# EAGLE design proto (EAGLE 7.3.0)
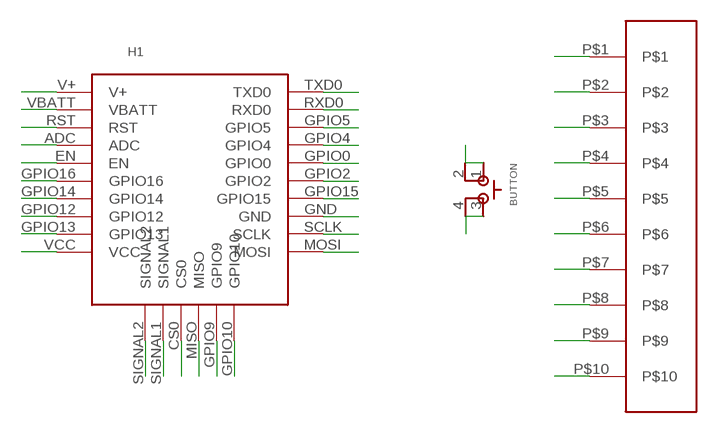
[diagram p0: schematic, sheet 1]

## Parts
BUTTON  SKSCLDE010  [SKSCLDE010]
H1  ESP-BOARD  [ESP-BOARD]
U$1  1X10-EDGE  [1X10-EDGE]

## Nets
ADC: H1.ADC
CS0: H1.CS0
EN: H1.EN
GND: H1.GND
GPIO0: H1.GPIO0
GPIO2: H1.GPIO2
GPIO4: H1.GPIO4
GPIO5: H1.GPIO5
GPIO9: H1.GPIO9
GPIO10: H1.GPIO10
GPIO12: H1.GPIO12
GPIO13: H1.GPIO13
GPIO14: H1.GPIO14
GPIO15: H1.GPIO15
GPIO16: H1.GPIO16
MISO: H1.MISO
MOSI: H1.MOSI
P0: U$1.P$10
P1: U$1.P$9
P2: U$1.P$8
P3: U$1.P$7
P4: U$1.P$6
P5: U$1.P$5
P6: U$1.P$4
P7: U$1.P$3
P8: U$1.P$2
P9: U$1.P$1
RST: H1.RST
RXD0: H1.RXD0
SCLK: H1.SCLK
SIGNAL1: H1.SIGNAL1
SIGNAL2: H1.SIGNAL2
SW1: BUTTON.3 BUTTON.4
SW2: BUTTON.1 BUTTON.2
TXD0: H1.TXD0
V+: H1.V+
VBATT: H1.VBATT
VCC: H1.VCC

## Library data of the parts
BUTTON = ESPstack:SKSCLDE010
H1 = ESPstack:ESP-BOARD: STANDARIZED ESP-STACK BOARD
U$1 = ESPstack:1X10-EDGE

## Board
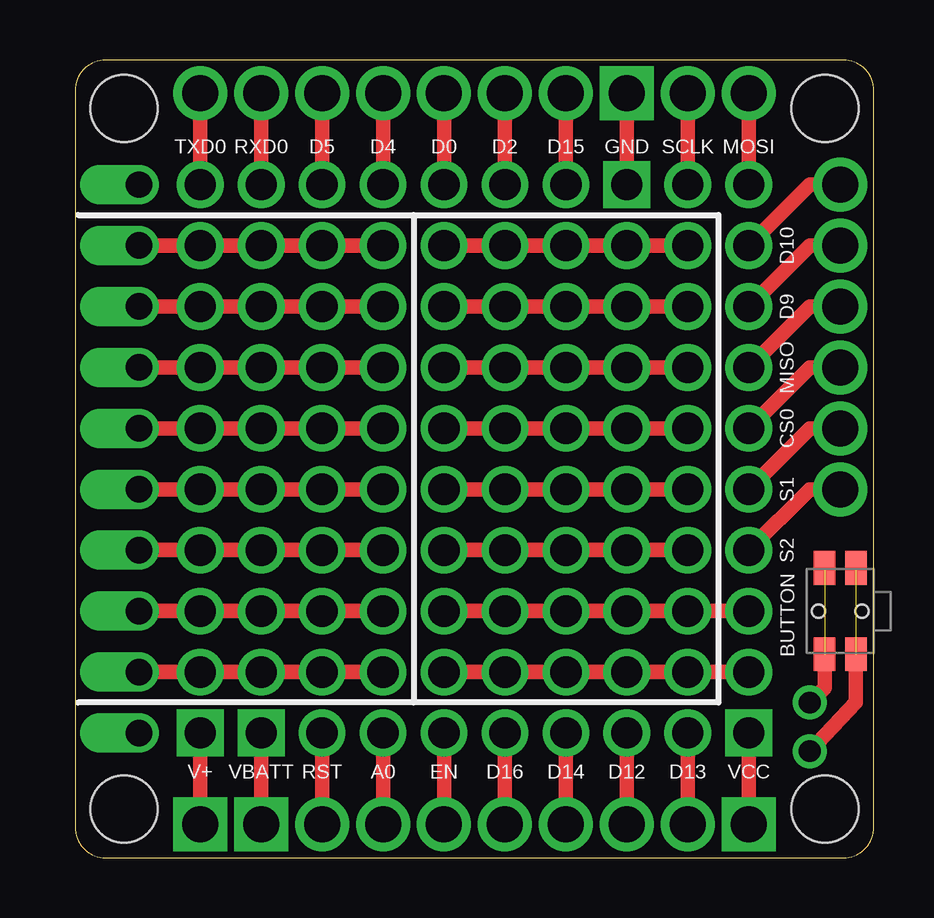
[diagram p1: board, top side]
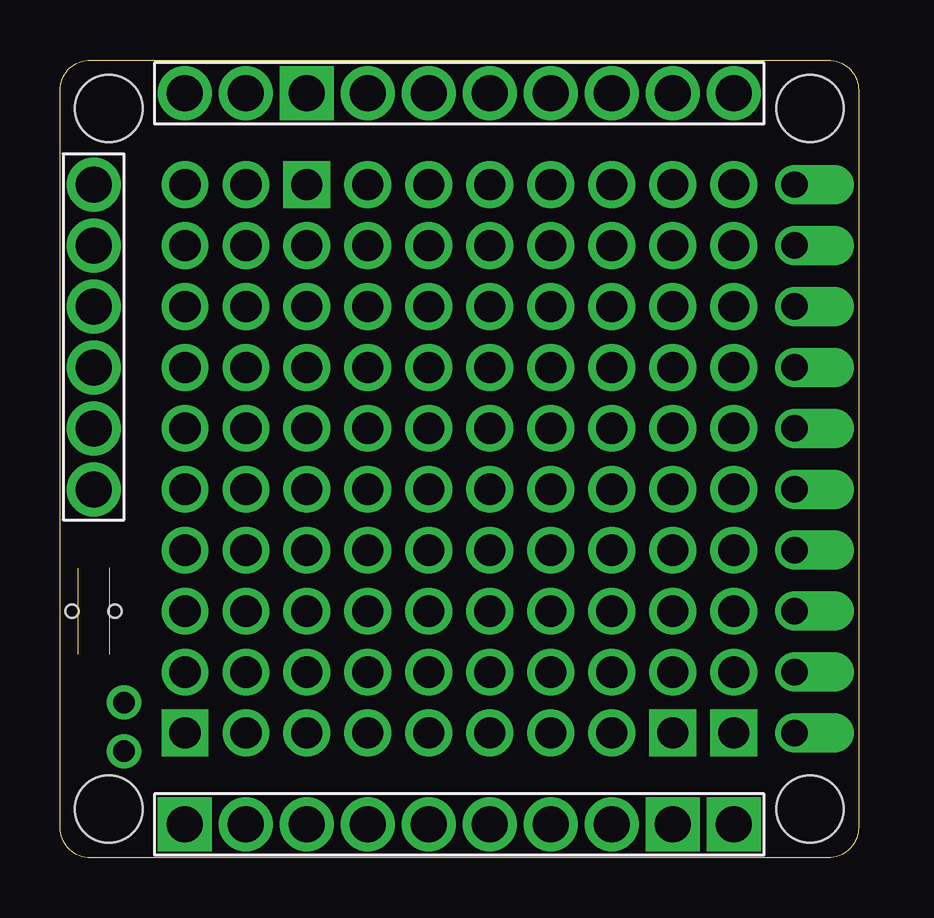
[diagram p2: board, bottom side, seen from below]

Size 33.27 x 33.26 mm. Coordinates in mm from the lower left corner, seen from the top.
Outline: 0,31.99 0,1.27 arc90 1.27,0 32,0 arc90 33.27,1.27 33.27,31.99 arc90 32,33.26 1.27,33.26 arc90 0,31.99
Copper layers (1*16): Top 0.035mm / dielectric 1.5mm / Bottom 0.035mm
Design rules "dirt_cheap_dirty_boards.v1": minimum track width 5mil, minimum drill 12mil, track to track 5mil, track to pad 5mil, pad to pad 5mil, via to via 5mil, smd to smd 0mil, copper to edge 10mil, drill to drill 10mil, minimum pad ring 10mil, minimum via ring 6mil, stop-mask expansion 2mil, vias tented up to drill 25mil, thermal gap 10mil

### Footprints (pad centres in the part's own frame; a part is rotated, then mirrored left to right if it is on the bottom)
SKSCLDE010 = smd 1.4 x 0.9: 1 -1.8,-0.65; 2 1.8,-0.65; 3 -1.8,0.65; 4 1.8,0.65 | hole 0.55: 0,0.9; 0,-0.9
ESP-BOARD = drill 1.5 pad 2.184: ADC -10.16,-16.51; CS0 8.89,2.54; EN -7.62,-16.51; GPIO0 -7.62,13.97; GPIO2 -5.08,13.97; GPIO4 -10.16,13.97; GPIO5 -12.7,13.97; GPIO9 8.89,7.62; GPIO10 8.89,10.16; GPIO12 0,-16.51; GPIO13 2.54,-16.51; GPIO14 -2.54,-16.51; GPIO15 -2.54,13.97; GPIO16 -5.08,-16.51; MISO 8.89,5.08; MOSI 5.08,13.97; RST -12.7,-16.51; RXD0 -15.24,13.97; SCLK 2.54,13.97; SIGNAL1 8.89,0; SIGNAL2 8.89,-2.54; TXD0 -17.78,13.97 | drill 1.5 pad 2.184 square: GND 0,13.97; V+ -17.78,-16.51; VBATT -15.24,-16.51; VCC 5.08,-16.51 | hole 2.8: 8.255,13.335; -20.955,13.335; 8.255,-15.875; -20.955,-15.875
1X10-EDGE = drill 1.1 pad 1.27 offset: P$1 0,11.43 | drill 1.1 pad 1.422 offset: P$2 0,8.89; P$3 0,6.35; P$4 0,3.81; P$5 0,1.27; P$6 0,-1.27; P$7 0,-3.81; P$8 0,-6.35; P$9 0,-8.89; P$10 0,-11.43

### Placement (x,y rotation side)
BUTTON  31.88,10.29 90 top
H1  22.99,17.91 0 top
U$1  2.67,16.64 0 top

### Tracks (layer width: path | path; a pad name or v marks a point on that pad's centre or on a via)
9  (via drill 1.3 pad 1.68)
  Top 0.61: v15.37,7.75 v17.91,7.75 v20.45,7.75 v22.99,7.75 v25.53,7.75 v28.07,7.75
10  (via drill 1.3 pad 1.68)
  Top 0.61: v28.07,10.29 v25.53,10.29 v22.99,10.29 v20.45,10.29 v17.91,10.29 v15.37,10.29
11  (via drill 1.3 pad 1.68)
  Top 0.61: v15.37,12.83 v17.91,12.83 v20.45,12.83 v22.99,12.83 v25.53,12.83
12  (via drill 1.3 pad 1.68)
  Top 0.61: v25.53,15.37 v22.99,15.37 v20.45,15.37 v17.91,15.37 v15.37,15.37
13  (via drill 1.3 pad 1.68)
  Top 0.61: v15.37,17.91 v17.91,17.91 v20.45,17.91 v22.99,17.91 v25.53,17.91
14  (via drill 1.3 pad 1.68)
  Top 0.61: v25.53,20.45 v22.99,20.45 v20.45,20.45 v17.91,20.45 v15.37,20.45
15  (via drill 1.3 pad 1.68)
  Top 0.61: v15.37,22.99 v17.91,22.99 v20.45,22.99 v22.99,22.99 v25.53,22.99
16  (via drill 1.3 pad 1.68)
  Top 0.61: v25.53,25.53 v22.99,25.53 v20.45,25.53 v17.91,25.53 v15.37,25.53
ADC  (via drill 1.3 pad 1.68)
  Top 0.61: v12.83,5.21 H1.ADC
CS0  (via drill 1.3 pad 1.68)
  Top 0.61: v28.07,17.91 30.61,20.45 H1.CS0
EN  (via drill 1.3 pad 1.68)
  Top 0.61: v15.37,5.21 H1.EN
GND  (via drill 1.3 pad 1.68)
  Top 0.61: v22.99,28.07 H1.GND
GPIO0  (via drill 1.3 pad 1.68)
  Top 0.61: v15.37,28.07 H1.GPIO0
GPIO2  (via drill 1.3 pad 1.68)
  Top 0.61: v17.91,28.07 H1.GPIO2
GPIO4  (via drill 1.3 pad 1.68)
  Top 0.61: v12.83,28.07 H1.GPIO4
GPIO5  (via drill 1.3 pad 1.68)
  Top 0.61: v10.29,28.07 H1.GPIO5
GPIO9  (via drill 1.3 pad 1.68)
  Top 0.61: v28.07,22.99 30.61,25.53 H1.GPIO9
GPIO10  (via drill 1.3 pad 1.68)
  Top 0.61: v28.07,25.53 30.61,28.07 H1.GPIO10
GPIO12  (via drill 1.3 pad 1.68)
  Top 0.61: v22.99,5.21 H1.GPIO12
GPIO13  (via drill 1.3 pad 1.68)
  Top 0.61: v25.53,5.21 H1.GPIO13
GPIO14  (via drill 1.3 pad 1.68)
  Top 0.61: v20.45,5.21 H1.GPIO14
GPIO15  (via drill 1.3 pad 1.68)
  Top 0.61: v20.45,28.07 H1.GPIO15
GPIO16  (via drill 1.3 pad 1.68)
  Top 0.61: v17.91,5.21 H1.GPIO16
MISO  (via drill 1.3 pad 1.68)
  Top 0.61: v28.07,20.45 30.61,22.99 H1.MISO
MOSI  (via drill 1.3 pad 1.68)
  Top 0.61: v28.07,28.07 H1.MOSI
P1  (via drill 1.3 pad 1.68)
  Top 0.61: v12.83,7.75 v10.29,7.75 v7.75,7.75 v5.21,7.75 U$1.P$9
P2  (via drill 1.3 pad 1.68)
  Top 0.61: v12.83,10.29 v10.29,10.29 v7.75,10.29 v5.21,10.29 U$1.P$8
P3  (via drill 1.3 pad 1.68)
  Top 0.61: v12.83,12.83 v10.29,12.83 v7.75,12.83 v5.21,12.83 U$1.P$7
P4  (via drill 1.3 pad 1.68)
  Top 0.61: v12.83,15.37 v10.29,15.37 v7.75,15.37 v5.21,15.37 U$1.P$6
P5  (via drill 1.3 pad 1.68)
  Top 0.61: v12.83,17.91 v10.29,17.91 v7.75,17.91 v5.21,17.91 U$1.P$5
P6  (via drill 1.3 pad 1.68)
  Top 0.61: v12.83,20.45 v10.29,20.45 v7.75,20.45 v5.21,20.45 U$1.P$4
P7  (via drill 1.3 pad 1.68)
  Top 0.61: v12.83,22.99 v10.29,22.99 v7.75,22.99 v5.21,22.99 U$1.P$3
P8  (via drill 1.3 pad 1.68)
  Top 0.61: v12.83,25.53 v10.29,25.53 v7.75,25.53 v5.21,25.53 U$1.P$2
RST  (via drill 1.3 pad 1.68)
  Top 0.61: v10.29,5.21 H1.RST
RXD0  (via drill 1.3 pad 1.68)
  Top 0.61: v7.75,28.07 H1.RXD0
SCLK  (via drill 1.3 pad 1.68)
  Top 0.61: v25.53,28.07 H1.SCLK
SIGNAL1  (via drill 1.3 pad 1.68)
  Top 0.61: v28.07,15.37 30.61,17.91 H1.SIGNAL1
SIGNAL2  (via drill 1.3 pad 1.68)
  Top 0.61: v28.07,12.83 30.61,15.37 H1.SIGNAL2
SW1  (via drill 0.9 pad 1.42)  (1 unrouted)
  Top 0.61: v30.61,6.48 31.23,7.1 BUTTON.3
SW2  (via drill 0.9 pad 1.42)  (1 unrouted)
  Top 0.61: v30.61,4.45 32.53,6.49 BUTTON.1
TXD0  (via drill 1.3 pad 1.68)
  Top 0.61: v5.21,28.07 H1.TXD0
V+  (via drill 1.3 pad 1.68)
  Top 0.61: H1.V+ v5.21,5.21
VBATT  (via drill 1.3 pad 1.68)
  Top 0.61: v7.75,5.21 H1.VBATT
VCC  (via drill 1.3 pad 1.68)
  Top 0.61: v28.07,5.21 H1.VCC

### Text on the board
tPlace: TXD0 | RXD0 | D5 | D4 | D0 | D2 | D15 | GND | SCLK | MOSI | D10 | D9 | MISO | CS0 | S1 | S2 | V+ | VBATT | RST | A0 | EN | D16 | D14 | D12 | D13 | VCC